# Altium schematic sheet Voeding.SchDoc
size A4; SheetNumber: 3; SheetTotal: 5
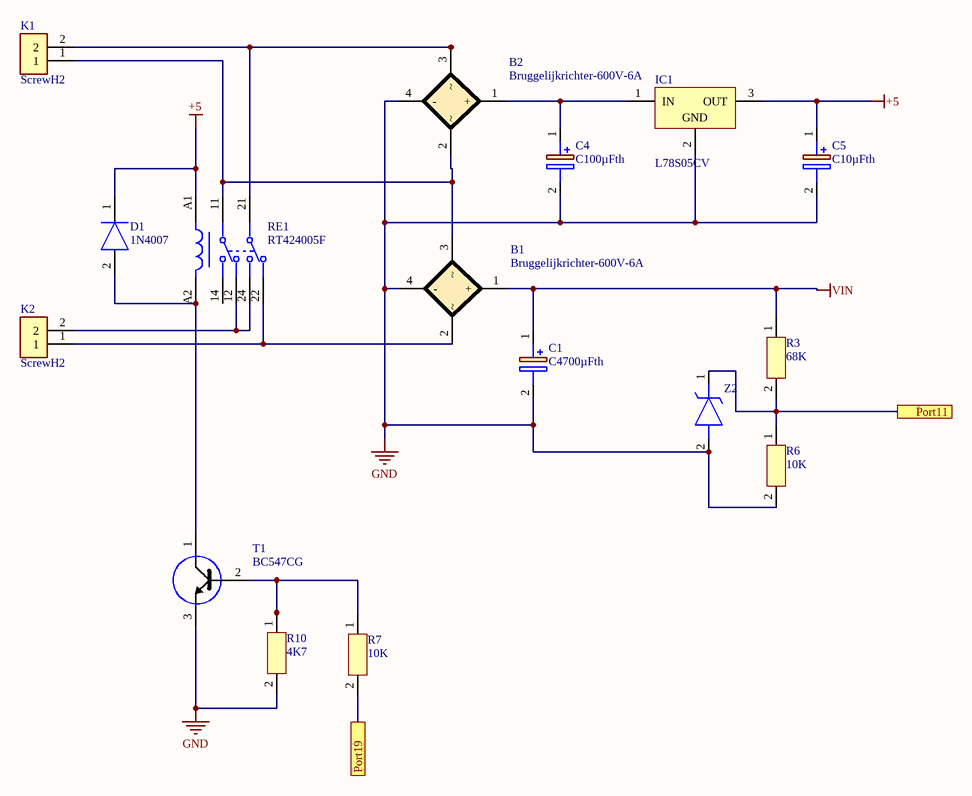
[diagram p0: Voeding.SchDoc]

## Parts
B1  Bruggelijkrichter-600V-6A  [Bruggelijkrichter-600V-6A]
B2  Bruggelijkrichter-600V-6A  [Bruggelijkrichter-600V-6A]
C1  C4700µFth  [C4700µFth]
C4  C100µFth  [C100µFth]
C5  C10µFth  [C10µFth]
D1  1N4007  [1N4007]
IC1  L78S05CV  [5V_Regulator-2A]
K1  ScrewH2  [ScewH2]
K2  ScrewH2  [ScewH2]
R3  68K  [0805]
R6  10K  [0805]
R7  10K  [0805]
R10  4K7  [0805]
RE1  RT424005F  [vermogenrelais-5VDC-8A]
T1  BC547CG  [BC547C]
Z2  zenerdiode-5,1V-0,5W  [zenerdiode-5,1V-0,5W]  (value not drawn)

## Ports
Port11, Port19

## Nets
+5: C5.1(+) D1.1(K) IC1.3(OUT) RE1.A1
GND: B1.4(-) B2.4(-) C1.2(-) C4.2(-) C5.2(-) IC1.2(GND) R6.2 R10.2 T1.3(E) Z2.2(A)
VIN: B1.1(+) C1.1(+) R3.1
Port11: R3.2 R6.1 Z2.1(K) ; port Port11
Port19: R7.2 ; port Port19
NetB1_2: B1.2 K2.1 RE1.22
NetB1_3: B1.3 B2.2 K1.1 RE1.11
NetB2_1: B2.1(+) C4.1(+) IC1.1(IN)
NetB2_3: B2.3 K1.2 RE1.21
NetD1_2: D1.2(A) RE1.A2 T1.1(C)
NetK2_2: K2.2 RE1.12 RE1.24
NetR7_1: R7.1 R10.1 T1.2(B)

Not connected (* = marked no-connect by the designer): RE1 14

## Library data of the parts
B1 B2 = Bruggelijkrichter-600V-6A: Bridge Rectifier; Manufacturer_Name: Vishay; Manufacturer_Part_Number: GBU6J-E3/45; Datasheet Link: http://www.vishay.com/docs/88615/gbu6a.pdf; Height: 18.8mm
C1 = C4700µFth: Capacitor Polarised; Manufacturer_Name: Kemet; Manufacturer_Part_Number: ESK478M050AQ3AA; Datasheet Link: https://componentsearchengine.com//ESK478M050AQ3AA.pdf; Height: 37mm; Mouser2 Part Number: 80-ESK478M050AQ3AA; Mouser2 Price/Stock: https://www.mouser.com/Search/Refine.aspx?Keyword=80-ESK478M050AQ3AA
C4 = C100µFth: Capacitor Polarised; Manufacturer_Name: Kemet; Manufacturer_Part_Number: ESK107M050AG3EA; Height: 12.5mm
C5 = C10µFth: Capacitor Polarised; Manufacturer_Name: Panasonic; Manufacturer_Part_Number: ECA-1HM100I; Datasheet Link: https://componentsearchengine.com//ECA-1HM100I.pdf; Height: 12mm; Mouser2 Part Number: 667-ECA-1HM100I; Mouser2 Price/Stock: https://www.mouser.com/Search/Refine.aspx?Keyword=667-ECA-1HM100I
D1 = 1N4007: Diode; Manufacturer_Name: Rectron; Manufacturer_Part_Number: 1N4007-T; Datasheet Link: https://componentsearchengine.com//1N4007-T.pdf; Mouser2 Part Number: 583-1N4007-T; Mouser2 Price/Stock: https://www.mouser.com/Search/Refine.aspx?Keyword=583-1N4007-T
IC1 = 5V_Regulator-2A: 2A Positive Voltage Regulator, 5V, 3-Pin TO-220; PackageVersion: ver3.0; ComponentLink2URL: http://www.st.com/internet/com/TECHNICAL_RESOURCES/TECHNICAL_LITERATURE/DATASHEET/CD00000449.pdf; ComponentLink1Description: Manufacturer URL; DatasheetVersion: 1/03/2010; PackageDescription: TO, Thru-Hole, Vertical, Heatsink Mounted; 3 In-Line Leads; Pitch 2.54 mm; ComponentLink2Description: Datasheet; ComponentLink1URL: http://www.st.com; ComponentLink3Description: Package Specification; PackageReference: TO220; ComponentLink3URL: http://www.st.com/internet/com/TECHNICAL_RESOURCES/TECHNICAL_LITERATURE/PACKAGE_INFORMATION/CD00004649.pdf
K1 K2 = ScrewH2: Connector; Manufacturer_Name: CUI Inc.; Manufacturer_Part_Number: TB007-508-02BE; Datasheet Link: https://componentsearchengine.com//TB007-508-02BE.pdf; Height: 14mm; Mouser2 Part Number: 490-TB007-508-02BE; Mouser2 Price/Stock: https://www.mouser.com/Search/Refine.aspx?Keyword=490-TB007-508-02BE
R3 R6 R7 R10 = R-0805: Resistor; Manufacturer_Name: Vishay; Manufacturer_Part_Number: TNPU0805500RAZEN00; Height: 0.55mm
RE1 = vermogenrelais-5VDC-8A: RELAY GENERAL PURPOSE DPDT 8A 5V; Power Consumption: 400mW; Coil Current: 80.6mA; Max Voltage Rating (AC): 400V; Coil Power: 500mW; Dropout Voltage: 500mV; Operate Time: 7ms; Contact Voltage Rating (AC): 250V; Coil Type: Non-Latching; Coil Resistance: 62R; Release Time: 3ms; Max Operating Temperature: 85°C; Package Quantity: 5000; Relay Type: General Purpose; Series: RT2; Lead Free: Lead Free; Coil Voltage (DC): 5V; Contact Current Rating: 8A; Packaging: Carton; Height: 15.7mm; Mount: Through Hole; Width: 12.7mm; ELV: Compliant; Termination: PCB; Contact Material: Silver; Throw Configuration: DPDT; Min Operating Temperature: -40°C; Weight: 13g; RoHS Compliant: Yes; Length: 29mm; Radiation Hardening: No
T1 = BC547C: Amplifier Transistor, NPN Silicon, 3-Pin TO-92, Pb-Free, Bulk Box; Manufacturer: On Semiconductor; IC Continuous (A): 0.1; fT Min (MHz): 150; ComponentLink3URL: http://www.onsemi.cn/pub_link/Collateral/2N6426-D.PDF; Mounting Technology: Through Hole; PackageReference: TO-92-3-29-11_AM_SL; ComponentLink2Description: Datasheet; RoHS: TRUE; Packing: Bulk Box; ComponentLink1Description: Manufacturer URL; PackageDescription: 3-Pin Transistor Outline, Body 4.825 x 3.685 mm, Pitch 1.27 mm; PackageVersion: Rev. AM; ComponentLink2URL: http://www.onsemi.com/pub_link/Collateral/BC546-D.PDF; ComponentLink3Description: Package Specification; ComponentLink1URL: http://www.onsemi.com/; DatasheetVersion: Rev. 7; Polarity: NPN; PartNumber: BC547CG
Z2 = zenerdiode-5,1V-0,5W: Zener Diode; Manufacturer_Name: ON Semiconductor; Manufacturer_Part_Number: MM5Z4689T1G; Datasheet Link: https://www.mouser.in/datasheet/2/308/1/MM5Z4678T1_D-2315920.pdf; Height: 0.7mm